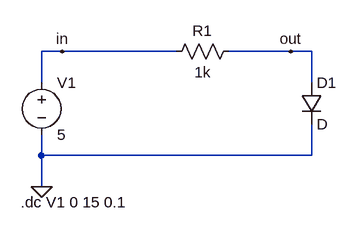
[diagram p0: schematic Draft1.asc]
Draft1.asc, the LTspice schematic file:
Version 4.1
SHEET 1 880 680
WIRE 16 32 -16 32
WIRE 192 32 16 32
WIRE 368 32 272 32
WIRE 400 32 368 32
WIRE -16 80 -16 32
WIRE 400 80 400 32
WIRE -16 192 -16 160
WIRE 400 192 400 144
WIRE 400 192 -16 192
WIRE -16 240 -16 192
FLAG -16 240 0
FLAG 16 32 in
FLAG 368 32 out
SYMBOL voltage -16 64 R0
SYMATTR InstName V1
SYMATTR Value 5
SYMBOL res 288 16 R90
WINDOW 0 0 56 VBottom 2
WINDOW 3 32 56 VTop 2
SYMATTR InstName R1
SYMATTR Value 1k
SYMBOL diode 384 80 R0
SYMATTR InstName D1
TEXT -48 264 Left 2 !.dc V1 0 15 0.1

The netlist it stands for:
* Draft1.asc
V1 in 0 5
R1 out in 1k
D1 out 0 D
.model D D
.lib standard.dio
.dc V1 0 15 0.1
.backanno
.end

* Results of the author's LTspice run, read from the files saved beside the schematic
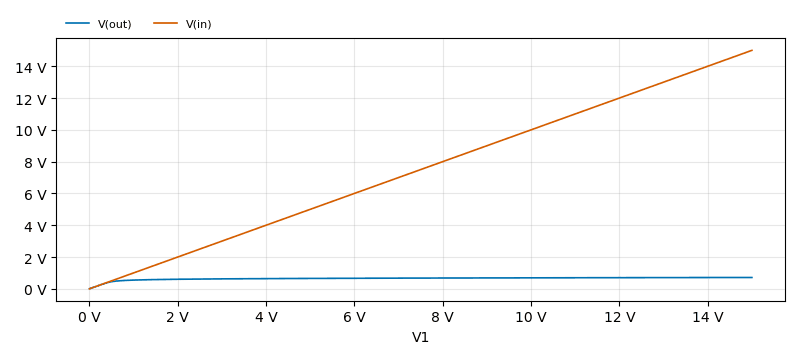
[diagram p1: DC transfer characteristic of Draft1.asc, plotted from the saved traces]
* DC transfer characteristic, 1 run:
*   V(out): 0 V at V1=0 V, 712.8 mV at V1=15 V, min 0 V, max 712.8 mV
*   V(in): 0 V at V1=0 V, 15 V at V1=15 V, min 0 V, max 15 V